# Altium schematic sheet Sheet1.SchDoc
size A3; SheetNumber: 1; SheetTotal: 1
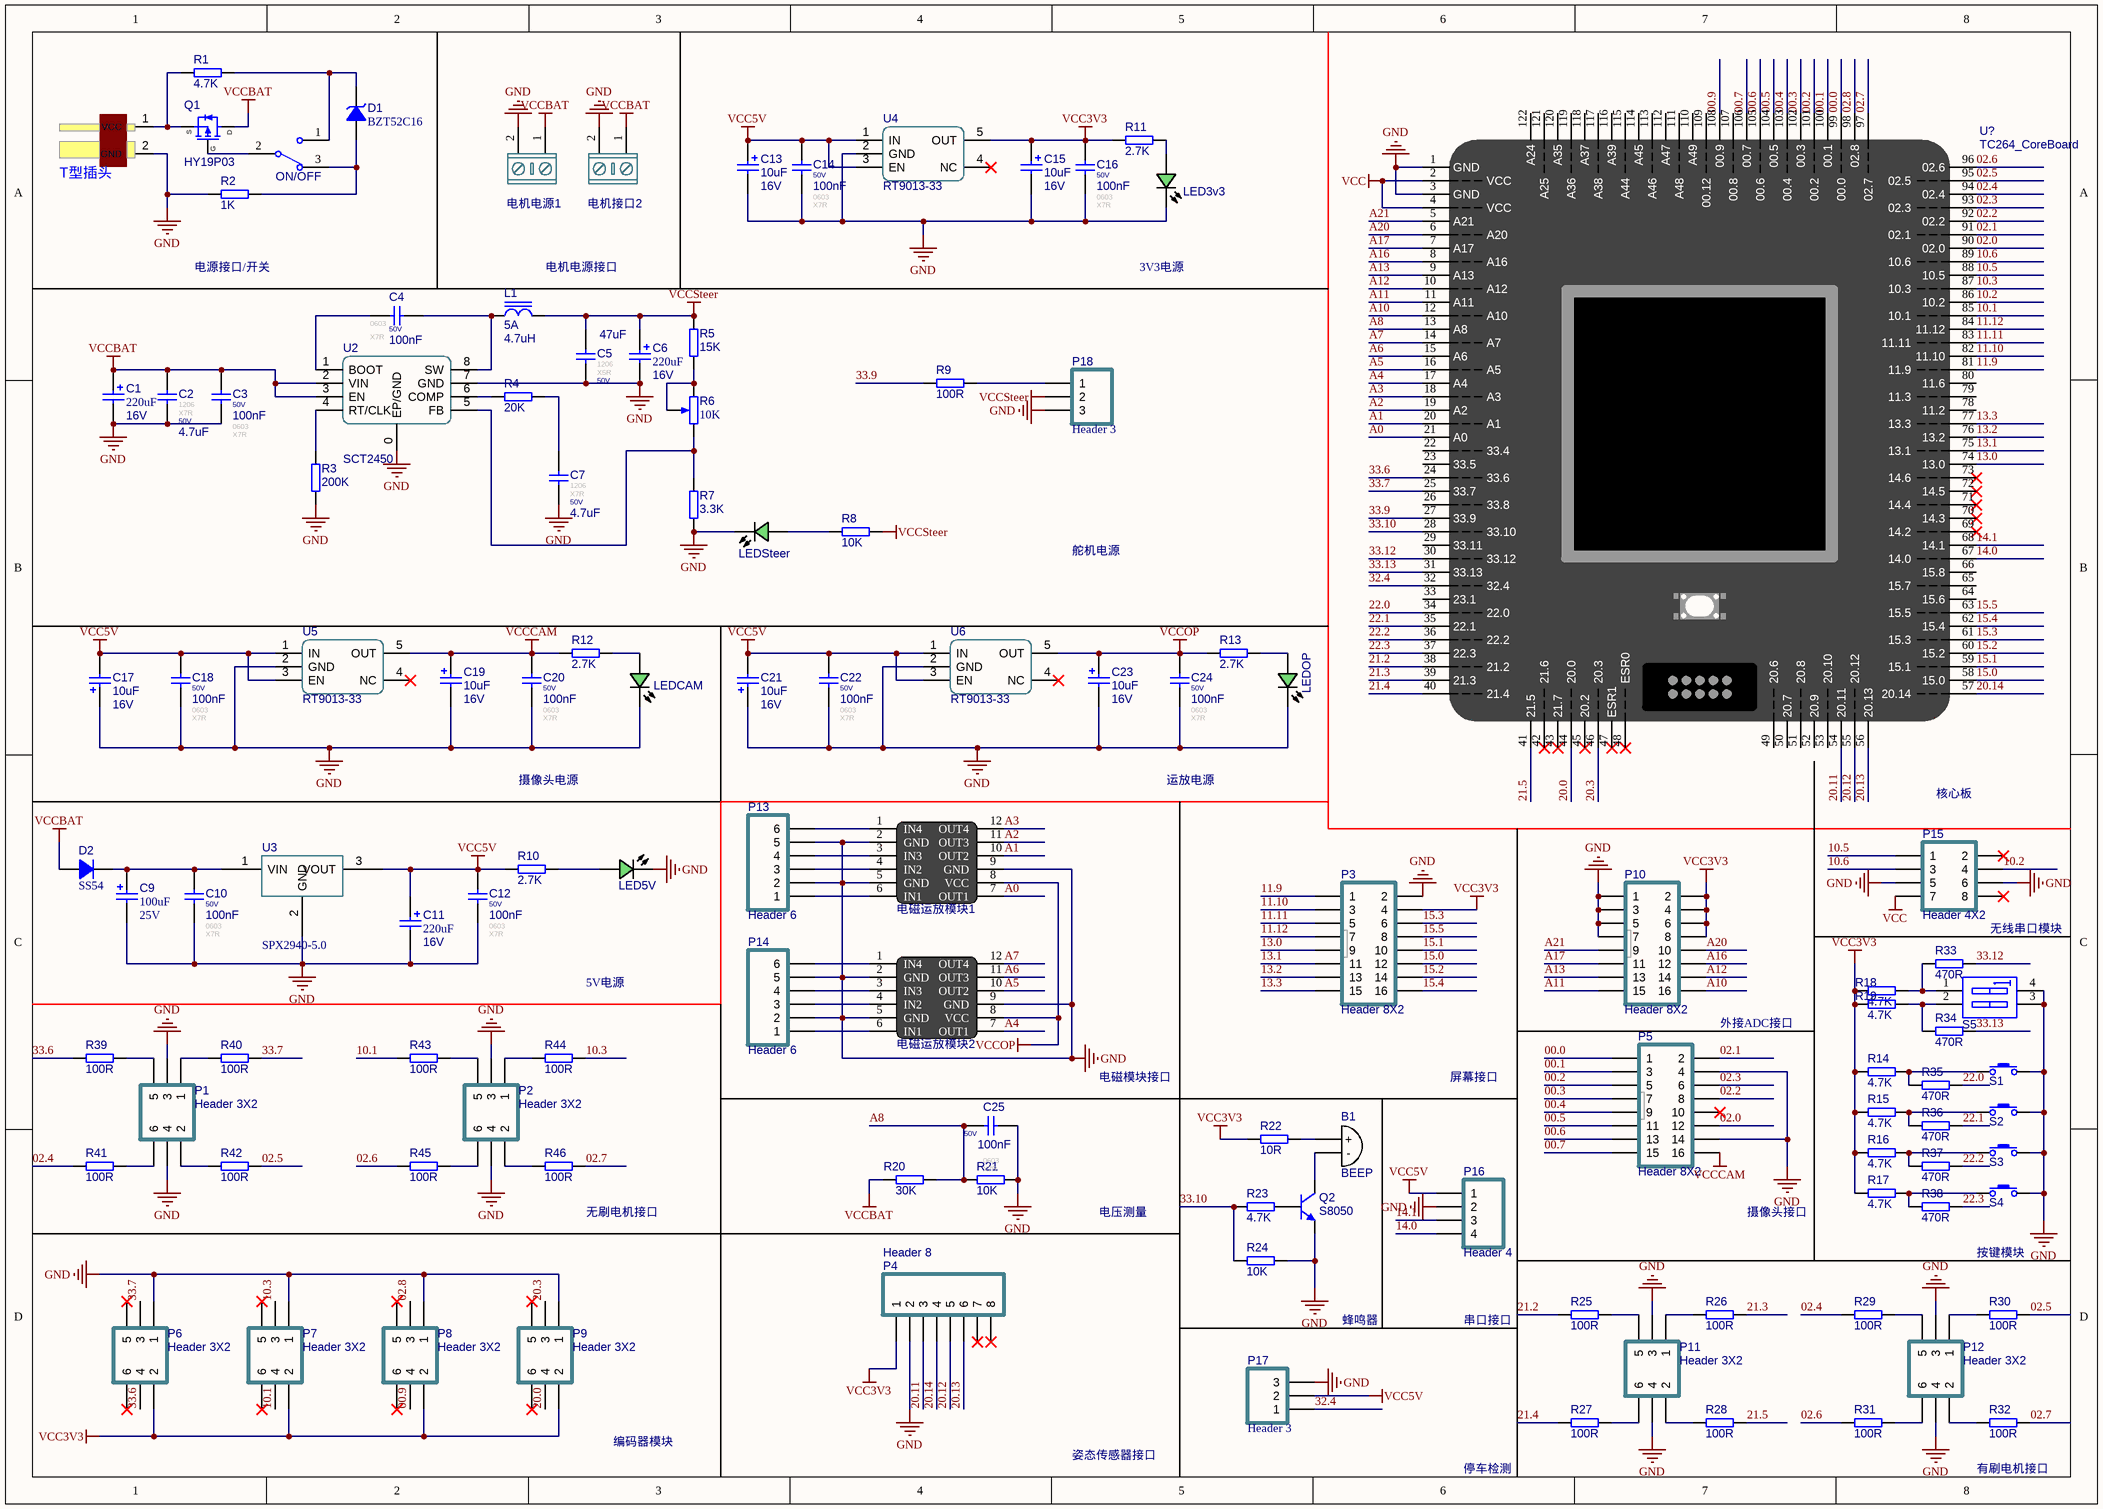
[diagram p0: Sheet1.SchDoc]

## Parts
B1  BEEP  [BEEP 9x5.5mm]
C1  value 220uF  Voltage: 16V  [CAPS6.3]  (hidden comment: 220uF 16V)
C2  value 4.7uF  Footprint: 1206  Type: X7R  Voltage: 50V  [CAPC3216[1206]S]  (hidden comment: 4.7uF ±10% 50V)
C3  value 100nF  Voltage: 50V  Footprint: 0603  Type: X7R  [CAPC3216[1206]S]  (hidden comment: 100nF ±10% 50V)
C4  value 100nF  Voltage: 50V  Footprint: 0603  Type: X7R  [CAPC3216[1206]S]  (hidden comment: 100nF ±10% 50V)
C5  value 47uF  Footprint: 1206  Type: X5R  Voltage: 50V  [CAPC3216[1206]S]  (hidden comment: 47uF ±10% 50V)
C6  value 220uF  Voltage: 16V  [CAPS6.3]  (hidden comment: 220uF 16V)
C7  value 4.7uF  Footprint: 1206  Type: X7R  Voltage: 50V  [CAPC3216[1206]S]  (hidden comment: 4.7uF ±10% 50V)
C9  value 100uF  Voltage: 25V  [CAPS6.3]  (hidden comment: 100uF 25V)
C10  value 100nF  Voltage: 50V  Footprint: 0603  Type: X7R  [CAPC3216[1206]S]  (hidden comment: 100nF ±10% 50V)
C11  value 220uF  Voltage: 16V  [CAPS6.3]  (hidden comment: 220uF 16V)
C12  value 100nF  Voltage: 50V  Footprint: 0603  Type: X7R  [CAPC3216[1206]S]  (hidden comment: 100nF ±10% 50V)
C13  value 10uF  Voltage: 16V  [CAPT3216]  (hidden comment: 10uF 16V)
C14  value 100nF  Voltage: 50V  Footprint: 0603  Type: X7R  [CAPC3216[1206]S]  (hidden comment: 100nF ±10% 50V)
C15  value 10uF  Voltage: 16V  [CAPT3216]  (hidden comment: 10uF 16V)
C16  value 100nF  Voltage: 50V  Footprint: 0603  Type: X7R  [CAPC3216[1206]S]  (hidden comment: 100nF ±10% 50V)
C17  value 10uF  Voltage: 16V  [CAPT3216]  (hidden comment: 10uF 16V)
C18  value 100nF  Voltage: 50V  Footprint: 0603  Type: X7R  [CAPC3216[1206]S]  (hidden comment: 100nF ±10% 50V)
C19  value 10uF  Voltage: 16V  [CAPT3216]  (hidden comment: 10uF 16V)
C20  value 100nF  Voltage: 50V  Footprint: 0603  Type: X7R  [CAPC3216[1206]S]  (hidden comment: 100nF ±10% 50V)
C21  value 10uF  Voltage: 16V  [CAPT3216]  (hidden comment: 10uF 16V)
C22  value 100nF  Voltage: 50V  Footprint: 0603  Type: X7R  [CAPC3216[1206]S]  (hidden comment: 100nF ±10% 50V)
C23  value 10uF  Voltage: 16V  [CAPT3216]  (hidden comment: 10uF 16V)
C24  value 100nF  Voltage: 50V  Footprint: 0603  Type: X7R  [CAPC3216[1206]S]  (hidden comment: 100nF ±10% 50V)
C25  value 100nF  Voltage: 50V  Footprint: 0603  Type: X7R  [CAPC3216[1206]S]  (hidden comment: 100nF ±10% 50V)
D1  BZT52C16  [SOD-123-L]
D2  SS54  [SMA[DO-214AC]]
L1  value 4.7uH  Imax: 5A  [0630 TPC 7*7*3]  (hidden comment: 4.7uH 5A)
LED3v3  翠绿贴片LED  [LEDC1608(0603)]  (value not drawn)
LED5V  翠绿贴片LED  [LEDC1608(0603)]  (value not drawn)
LEDCAM  翠绿贴片LED  [LEDC1608(0603)]  (value not drawn)
LEDOP  翠绿贴片LED  [LEDC1608(0603)]  (value not drawn)
LEDSteer  翠绿贴片LED  [LEDC1608(0603)]  (value not drawn)
ON/OFF  SW-SPDT  [SS12D10]  (value not drawn)
P1  Header 3X2  [HDR2X3-M-SMT]
P2  Header 3X2  [HDR2X3-M-SMT]
P3  Header 8X2  [HDR2X8-M-SMT]
P4  Header 8  [HDR1X8]
P5  Header 8X2  [HDR2X8-M-SMT]
P6  Header 3X2  [HDR2X3-M-SMT]
P7  Header 3X2  [HDR2X3-M-SMT]
P8  Header 3X2  [HDR2X3-M-SMT]
P9  Header 3X2  [HDR2X3-M-SMT]
P10  Header 8X2  [HDR2X8-M-SMT]
P11  Header 3X2  [HDR2X3-M-SMT]
P12  Header 3X2  [HDR2X3-M-SMT]
P13  Header 6  [HDR1X6]
P14  Header 6  [HDR1X6]
P15  Header 4X2  [Female-Header-2.54-SMD-8]
P16  Header 4  [HDR1X4]
P17  Header 3  [HDR1X3]
P18  Header 3  [HDR1X3]
Q1  HY19P03  [TO-252AA]
Q2  S8050  [SOT-23]
R1  value 4.7K  [RESC1608[0603]S-N]  (hidden comment: 4.7K ±1%)
R2  value 1K  [RESC1608[0603]S-N]  (hidden comment: 1K ±1%)
R3  value 200K  [RESC1608[0603]S-N]  (hidden comment: 200K ±1%)
R4  value 20K  [RESC1608[0603]S-N]  (hidden comment: 20K ±1%)
R5  value 15K  [RESC1608[0603]S-N]  (hidden comment: 15K ±1%)
R6  10K  [RESPOT3296]
R7  value 3.3K  [RESC1608[0603]S-N]  (hidden comment: 3.3K ±1%)
R8  value 10K  [RESC1608[0603]S-N]  (hidden comment: 10K ±1%)
R9  value 100R  [RESC1608[0603]S-N]  (hidden comment: 100R ±1%)
R10  value 2.7K  [RESC1608[0603]S-N]  (hidden comment: 2.7K ±1%)
R11  value 2.7K  [RESC1608[0603]S-N]  (hidden comment: 2.7K ±1%)
R12  value 2.7K  [RESC1608[0603]S-N]  (hidden comment: 2.7K ±1%)
R13  value 2.7K  [RESC1608[0603]S-N]  (hidden comment: 2.7K ±1%)
R14  value 4.7K  [RESC1608[0603]S-N]  (hidden comment: 4.7K ±1%)
R15  value 4.7K  [RESC1608[0603]S-N]  (hidden comment: 4.7K ±1%)
R16  value 4.7K  [RESC1608[0603]S-N]  (hidden comment: 4.7K ±1%)
R17  value 4.7K  [RESC1608[0603]S-N]  (hidden comment: 4.7K ±1%)
R18  value 4.7K  [RESC1608[0603]S-N]  (hidden comment: 4.7K ±1%)
R19  value 4.7K  [RESC1608[0603]S-N]  (hidden comment: 4.7K ±1%)
R20  value 30K  [RESC1608[0603]S-N]  (hidden comment: 30K ±1%)
R21  value 10K  [RESC1608[0603]S-N]  (hidden comment: 10K ±1%)
R22  value 10R  [RESC1608[0603]S-N]  (hidden comment: 10R ±1%)
R23  value 4.7K  [RESC1608[0603]S-N]  (hidden comment: 4.7K ±1%)
R24  value 10K  [RESC1608[0603]S-N]  (hidden comment: 10K ±1%)
R25  value 100R  [RESC1608[0603]S-N]  (hidden comment: 100R ±1%)
R26  value 100R  [RESC1608[0603]S-N]  (hidden comment: 100R ±1%)
R27  value 100R  [RESC1608[0603]S-N]  (hidden comment: 100R ±1%)
R28  value 100R  [RESC1608[0603]S-N]  (hidden comment: 100R ±1%)
R29  value 100R  [RESC1608[0603]S-N]  (hidden comment: 100R ±1%)
R30  value 100R  [RESC1608[0603]S-N]  (hidden comment: 100R ±1%)
R31  value 100R  [RESC1608[0603]S-N]  (hidden comment: 100R ±1%)
R32  value 100R  [RESC1608[0603]S-N]  (hidden comment: 100R ±1%)
R33  value 470R  [RESC1608[0603]S-N]  (hidden comment: 470R ±1%)
R34  value 470R  [RESC1608[0603]S-N]  (hidden comment: 470R ±1%)
R35  value 470R  [RESC1608[0603]S-N]  (hidden comment: 470R ±1%)
R36  value 470R  [RESC1608[0603]S-N]  (hidden comment: 470R ±1%)
R37  value 470R  [RESC1608[0603]S-N]  (hidden comment: 470R ±1%)
R38  value 470R  [RESC1608[0603]S-N]  (hidden comment: 470R ±1%)
R39  value 100R  [RESC1608[0603]S-N]  (hidden comment: 100R ±1%)
R40  value 100R  [RESC1608[0603]S-N]  (hidden comment: 100R ±1%)
R41  value 100R  [RESC1608[0603]S-N]  (hidden comment: 100R ±1%)
R42  value 100R  [RESC1608[0603]S-N]  (hidden comment: 100R ±1%)
R43  value 100R  [RESC1608[0603]S-N]  (hidden comment: 100R ±1%)
R44  value 100R  [RESC1608[0603]S-N]  (hidden comment: 100R ±1%)
R45  value 100R  [RESC1608[0603]S-N]  (hidden comment: 100R ±1%)
R46  value 100R  [RESC1608[0603]S-N]  (hidden comment: 100R ±1%)
S1  Button  [PTS810-3*4-CurvePin]  (value not drawn)
S2  Button  [PTS810-3*4-CurvePin]  (value not drawn)
S3  Button  [PTS810-3*4-CurvePin]  (value not drawn)
S4  Button  [PTS810-3*4-CurvePin]  (value not drawn)
S5  SW DIP-2  [Code SW-2-DIP-2.54]  (value not drawn)
U2  SCT2450  [SOP-8E]
U3  SPX2940-5.0  [TO-263-3]
U4  RT9013-33  [SOT-23-5]
U5  RT9013-33  [SOT-23-5]
U6  RT9013-33  [SOT-23-5]
U?  TC264_CoreBoard  [TC264_CoreBoard]
电机接口2  KF/WJ/DG 30x connecter  [KF/WJ/DG 301-2p-5.0mm]  (value not drawn)
电机电源1  KF/WJ/DG 30x connecter  [KF/WJ/DG 301-2p-5.0mm]  (value not drawn)
电源供电  T型插头  [Wired T-Header ThroughHole]
电磁运放模块1  OPA_MOD  [SEEKFREE_4CHANEL_OPAMOD]  (value not drawn)  (no BOM)
电磁运放模块2  OPA_MOD  [SEEKFREE_4CHANEL_OPAMOD]  (value not drawn)  (no BOM)

## Nets
GND: C1.2 C2.1 C3.1 C5.1 C6.2 C7.1 C9.2 C10.1 C11.2 C12.1 C13.2 C14.2 C15.2 C16.2 C17.1 C18.1 C19.2 C20.1 C21.1 C22.1 C23.2 C24.1 C25.2 LED3v3.C LED5V.C LEDCAM.C LEDOP.C LEDSteer.C P1.3 P1.4 P2.3 P2.4 P3.2 P4.2 P5.4 P5.14 P6.1 P7.1 P8.1 P9.1 P10.1 P10.3 P10.5 P10.7 P11.3 P11.4 P12.3 P12.4 P13.2 P13.5 P14.2 P14.5 P15.5 P15.6 P16.2 P17.3 P18.3 Q2.2(E) R2.1 R3.1 R7.1 R21.2 R24.2 S1.1 S2.1 S3.1 S4.1 S5.3(B2) S5.4(B1) U2.0(EP/GND) U2.7(GND) U3.2(GND) U4.2(GND) U5.2(GND) U6.2(GND) U?.1(GND) U?.3(GND) 电机接口2.2 电机电源1.2 电源供电.2(GND) 电磁运放模块1.2(GND) 电磁运放模块1.5(GND) 电磁运放模块1.9(GND) 电磁运放模块2.2(GND) 电磁运放模块2.5(GND) 电磁运放模块2.9(GND)
VCC: P15.7 U?.2(VCC) U?.4(VCC)
VCC3V3: C15.1 C16.1 P3.4 P4.1 P6.2 P7.2 P8.2 P9.2 P10.2 P10.4 P10.6 P10.8 R11.1 R14.1 R15.1 R16.1 R17.1 R18.1 R19.1 R22.1 U4.5(OUT)
VCC5V: C11.1 C12.2 C13.1 C14.1 C17.2 C18.2 C21.2 C22.2 P16.1 P17.2 R10.1 U3.3(VOUT) U4.1(IN) U4.3(EN) U5.1(IN) U5.3(EN) U6.1(IN) U6.3(EN)
VCCBAT: C1.1 C2.2 C3.2 D2.A Q1.1(D) R20.1 U2.2(VIN) U2.3(EN) 电机接口2.1 电机电源1.1
VCCCAM: C19.1 C20.2 P5.16 R12.1 U5.5(OUT)
VCCOP: C23.1 C24.2 R13.1 U6.5(OUT) 电磁运放模块1.8(VCC) 电磁运放模块2.8(VCC)
VCCSteer: C5.2 C6.1 L1.2 P18.2 R5.2 R8.2
00.0: P5.1 U?.99(00.0)
00.1: P5.3 U?.100(00.1)
00.2: P5.5 U?.101(00.2)
00.3: P5.7 U?.102(00.3)
00.4: P5.9 U?.103(00.4)
00.5: P5.11 U?.104(00.5)
00.6: P5.13 U?.105(00.6)
00.7: P5.15 U?.106(00.7)
00.9: P8.4 U?.108(00.9)
02.0: P5.12 U?.90(02.0)
02.1: P5.2 U?.91(02.1)
02.2: P5.8 U?.92(02.2)
02.3: P5.6 U?.93(02.3)
02.4: R29.1 R41.1 U?.94(02.4)
02.5: R30.2 R42.2 U?.95(02.5)
02.6: R31.1 R45.1 U?.96(02.6)
02.7: R32.2 R46.2 U?.97(02.7)
02.8: P8.3 U?.98(02.8)
10.1: P7.4 R43.1 U?.85(10.1)
10.2: P15.4 U?.86(10.2)
10.3: P7.3 R44.2 U?.87(10.3)
10.5: P15.1 U?.88(10.5)
10.6: P15.3 U?.89(10.6)
11.9: P3.1 U?.81(11.9)
11.10: P3.3 U?.82(11.10)
11.11: P3.5 U?.83(11.11)
11.12: P3.7 U?.84(11.12)
13.0: P3.9 U?.74(13.0)
13.1: P3.11 U?.75(13.1)
13.2: P3.13 U?.76(13.2)
13.3: P3.15 U?.77(13.3)
14.0: P16.4 U?.67(14.0)
14.1: P16.3 U?.68(14.1)
15.0: P3.12 U?.58(15.0)
15.1: P3.10 U?.59(15.1)
15.2: P3.14 U?.60(15.2)
15.3: P3.6 U?.61(15.3)
15.4: P3.16 U?.62(15.4)
15.5: P3.8 U?.63(15.5)
20.0: P9.4 U?.44(20.0)
20.3: P9.3 U?.46(20.3)
20.11: P4.3 U?.54(20.11)
20.12: P4.5 U?.55(20.12)
20.13: P4.6 U?.56(20.13)
20.14: P4.4 U?.57(20.14)
21.2: R25.1 U?.38(21.2)
21.3: R26.2 U?.39(21.3)
21.4: R27.1 U?.40(21.4)
21.5: R28.2 U?.41(21.5)
22.0: R35.2 U?.34(22.0)
22.1: R36.2 U?.35(22.1)
22.2: R37.2 U?.36(22.2)
22.3: R38.2 U?.37(22.3)
32.4: P17.1 U?.32(32.4)
33.6: P6.4 R39.1 U?.24(33.6)
33.7: P6.3 R40.2 U?.25(33.7)
33.9: R9.1 U?.27(33.9)
33.10: R23.1 R24.1 U?.28(33.10)
33.12: R33.2 U?.30(33.12)
33.13: R34.2 U?.31(33.13)
A0: U?.21(A0) 电磁运放模块1.7(OUT1)
A1: U?.20(A1) 电磁运放模块1.10(OUT2)
A2: U?.19(A2) 电磁运放模块1.11(OUT3)
A3: U?.18(A3) 电磁运放模块1.12(OUT4)
A4: U?.17(A4) 电磁运放模块2.7(OUT1)
A5: U?.16(A5) 电磁运放模块2.10(OUT2)
A6: U?.15(A6) 电磁运放模块2.11(OUT3)
A7: U?.14(A7) 电磁运放模块2.12(OUT4)
A8: C25.1 R20.2 R21.1 U?.13(A8)
A10: P10.16 U?.12(A10)
A11: P10.15 U?.11(A11)
A12: P10.14 U?.10(A12)
A13: P10.13 U?.9(A13)
A16: P10.12 U?.8(A16)
A17: P10.11 U?.7(A17)
A20: P10.10 U?.6(A20)
A21: P10.9 U?.5(A21)
NetB1_1: B1.1(+) R22.2
NetB1_2: B1.2(-) Q2.3(C)
NetC4_1: C4.1 U2.1(BOOT)
NetC4_2: C4.2 L1.1 U2.8(SW)
NetC7_2: C7.2 R4.2
NetC9_1: C9.1 C10.2 D2.K U3.1(VIN)
NetD1_A: D1.A ON/OFF.3 R2.2
NetD1_K: D1.K ON/OFF.1 R1.2
NetLED3v3_A: LED3v3.A R11.2
NetLED5V_A: LED5V.A R10.2
NetLEDCAM_A: LEDCAM.A R12.2
NetLEDOP_A: LEDOP.A R13.2
NetLEDSteer_A: LEDSteer.A R8.1
NetON/OFF_2: ON/OFF.2 Q1.2(G)
NetP1_1: P1.1 R40.1
NetP1_2: P1.2 R42.1
NetP1_5: P1.5 R39.2
NetP1_6: P1.6 R41.2
NetP2_1: P2.1 R44.1
NetP2_2: P2.2 R46.1
NetP2_5: P2.5 R43.2
NetP2_6: P2.6 R45.2
NetP11_1: P11.1 R26.1
NetP11_2: P11.2 R28.1
NetP11_5: P11.5 R25.2
NetP11_6: P11.6 R27.2
NetP12_1: P12.1 R30.1
NetP12_2: P12.2 R32.1
NetP12_5: P12.5 R29.2
NetP12_6: P12.6 R31.2
NetP13_1: P13.1 电磁运放模块1.6(IN1)
NetP13_3: P13.3 电磁运放模块1.4(IN2)
NetP13_4: P13.4 电磁运放模块1.3(IN3)
NetP13_6: P13.6 电磁运放模块1.1(IN4)
NetP14_1: P14.1 电磁运放模块2.6(IN1)
NetP14_3: P14.3 电磁运放模块2.4(IN2)
NetP14_4: P14.4 电磁运放模块2.3(IN3)
NetP14_6: P14.6 电磁运放模块2.1(IN4)
NetP18_1: P18.1 R9.2
NetQ1_3: Q1.3(S) R1.1 电源供电.1(VCC)
NetQ2_1: Q2.1(B) R23.2
NetR3_2: R3.2 U2.4(RT/CLK)
NetR4_1: R4.1 U2.6(COMP)
NetR5_1: R5.1 R6.1(TOP) R6.ADJ
NetR6_2: R6.2(BOT) R7.2 U2.5(FB)
NetR14_2: R14.2 R35.1 S1.2
NetR15_2: R15.2 R36.1 S2.2
NetR16_2: R16.2 R37.1 S3.2
NetR17_2: R17.2 R38.1 S4.2
NetR18_2: R18.2 R33.1 S5.1(A1)
NetR19_2: R19.2 R34.1 S5.2(A2)

Not connected (* = marked no-connect by the designer): P4 7* 8*; P5 10*; P6 5* 6*; P7 5* 6*; P8 5* 6*; P9 5* 6*; P15 2* 8*; U4 4(NC)*; U5 4(NC)*; U6 4(NC)*; U? 22(33.4) 23(33.5) 26(33.8) 29(33.11) 33(23.1) 42(21.6)* 43(21.7)* 45(20.2)* 47(ESR1)* 48(ESR0)* 49(20.6) 50(20.7) 51(20.8) 52(20.9) 53(20.10) 64(15.6) 65(15.7) 66(15.8) 69(14.2)* 70(14.3)* 71(14.4)* 72(14.5)* 73(14.6)* 78(11.2) 79(11.3) 80(11.6) 107(00.8) 109(00.12) 110(A49) 111(A48) 112(A47) 113(A46) 114(A45) 115(A44) 116(A39) 117(A38) 118(A37) 119(A36) 120(A35) 121(A25) 122(A24)

## Notes on the sheet
- 电源接口/开关
- (near L1) 电机电源接口
- 3V3电源
- 舵机电源
- 摄像头电源
- 运放电源
- 核心板
- 5V电源
- 无线串口模块
- 外接ADC接口
- 电磁模块接口
- 屏幕接口
- (near R46) 无刷电机接口
- 电压测量
- 摄像头接口
- 按键模块
- 蜂鸣器
- 串口接口
- 编码器模块
- 姿态传感器接口
- 停车检测
- (near R32) 有刷电机接口

## Library data of the parts
B1 = BEEP: 蜂鸣器
C1 C6 C11 = Cap-Solid_1: Polarized Capacitor (Radial); Published: 8-Jun-2000; Revision: July-2002: Re-released for DXP Platform.; Publisher: Altium Limited; Price(RMB): 0.000
C2 C7 = Cap-Chip_1: 贴片电容; Published: 2021-12-13; Revision: V1.2; Tolerance: ±10%
C3 C4 C10 C12 C14 C16 C18 C20 C22 C24 C25 = Cap-Chip: 贴片电容; Published: 2021-12-13; Revision: V1.2; Tolerance: ±10%
C5 = Cap-Chip_2: 贴片电容; Published: 2021-12-13; Revision: V1.2; Tolerance: ±10%
C9 = Cap-Solid: Polarized Capacitor (Radial); Published: 8-Jun-2000; Revision: July-2002: Re-released for DXP Platform.; Publisher: Altium Limited; Price(RMB): 0.000
C13 C15 C17 C19 C21 C23 = Cap-Tan: Tantalum Capacitor; Published: 8-Jun-2000; Revision: July-2002: Re-released for DXP Platform.; Publisher: Altium Limited; Price(RMB): 0.000
D1 = Diode TVS Uni-Dir: TRANSIENT VOLTAGE  SUPPRESSOR DIODE; Imax: 500mA; Published: 8-Jun-2000; Publisher: Altium Limited; Price(RMB): 0.000
D2 = Diode: 普通二极管 Diode; Imax: 500mA; Published: 8-Jun-2000; Revision: July-2002: Re-released for DXP Platform.; Publisher: Altium Limited; Price(RMB): 0.000
L1 = Ind-Power: 功率电感; DCR: .5m; Published: 8-Jun-2000; Revision: July-2002: Re-released for DXP Platform.; Publisher: Altium Limited; Price(RMB): 0.000
LED3v3 LED5V LEDCAM LEDOP LEDSteer = LED Chip Green: Published: 8-Jun-2000; Revision: July-2002: Re-released for DXP Platform.; Publisher: Altium Limited; Price(RMB): 0.00
ON/OFF = SW-SPDT: 单刀双掷开关 3脚船型、钮子、拨动开关 SPDT Subminiature Toggle Switch; Published: 24-Mar-1999; Publisher: Altium Limited; Price(RMB): 0.000
P1 P2 P6-P9 P11 P12 = Header 3X2: Header, 3-Pin, Dual row; LatestRevisionDate: 17-Jul-2002; LatestRevisionNote: Re-released for DXP Platform.; Publisher: Altium Limited; Price(RMB): 0.00
P3 P5 P10 = Header 8X2: Header, 8-Pin, Dual row; LatestRevisionDate: 17-Jul-2002; LatestRevisionNote: Re-released for DXP Platform.; Publisher: Altium Limited; Price(RMB): 0.00
P4 = Header 8: Header, 8-Pin; LatestRevisionDate: 17-Jul-2002; LatestRevisionNote: Re-released for DXP Platform.; Publisher: Altium Limited; Price(RMB): 0.00
P13 P14 = Header 6: Header, 6-Pin; LatestRevisionDate: 17-Jul-2002; LatestRevisionNote: Re-released for DXP Platform.; Publisher: Altium Limited; Price(RMB): 0.00
P15 = Header 4X2: Header, 4-Pin, Dual row; LatestRevisionDate: 17-Jul-2002; LatestRevisionNote: Re-released for DXP Platform.; Publisher: Altium Limited; Price(RMB): 0.00
P16 = Header 4: Header, 4-Pin; LatestRevisionDate: 17-Jul-2002; LatestRevisionNote: Re-released for DXP Platform.; Publisher: Altium Limited; Price(RMB): 0.00
P17 P18 = Header 3: Header, 3-Pin; LatestRevisionDate: 17-Jul-2002; LatestRevisionNote: Re-released for DXP Platform.; Publisher: Altium Limited; Price(RMB): 0.00
Q1 = HY19P03: HY19P03 P-Channel MOSFET
Q2 = NPN S8050: Discrete NPN Bipolar Transistor; Published: 8-Jun-2000; Revision: July-2002: Re-released for DXP Platform.; Publisher: Altium Limited; Price(RMB): 0.000; PartNumber: S8050
R1 R14-R19 R23 = Res-Chip_4: 贴片电阻; Published: 8-Jun-2000; Revision: July-2002: Re-released for DXP Platform.; Tolerance: ±1%
R2 = Res-Chip_3: 贴片电阻; Published: 8-Jun-2000; Revision: July-2002: Re-released for DXP Platform.; Tolerance: ±1%
R3 = Res-Chip_5: 贴片电阻; Published: 8-Jun-2000; Revision: July-2002: Re-released for DXP Platform.; Tolerance: ±1%
R4 = Res-Chip_6: 贴片电阻; Published: 8-Jun-2000; Revision: July-2002: Re-released for DXP Platform.; Tolerance: ±1%
R5 = Res-Chip_7: 贴片电阻; Published: 8-Jun-2000; Revision: July-2002: Re-released for DXP Platform.; Tolerance: ±1%
R6 = Res-Adj-3p: 可调电阻; Value: 10K
R7 = Res-Chip_8: 贴片电阻; Published: 8-Jun-2000; Revision: July-2002: Re-released for DXP Platform.; Tolerance: ±1%
R8 R21 R24 = Res-Chip: 贴片电阻; Published: 8-Jun-2000; Revision: July-2002: Re-released for DXP Platform.; Tolerance: ±1%
R9 R25-R32 R39-R46 = Res-Chip_1: 贴片电阻; Published: 8-Jun-2000; Revision: July-2002: Re-released for DXP Platform.; Tolerance: ±1%
R10-R13 = Res-Chip_2: 贴片电阻; Published: 8-Jun-2000; Revision: July-2002: Re-released for DXP Platform.; Tolerance: ±1%
R20 = Res-Chip_9: 贴片电阻; Published: 8-Jun-2000; Revision: July-2002: Re-released for DXP Platform.; Tolerance: ±1%
R22 = Res-Chip_10: 贴片电阻; Published: 8-Jun-2000; Revision: July-2002: Re-released for DXP Platform.; Tolerance: ±1%
R33-R38 = Res-Chip_11: 贴片电阻; Published: 8-Jun-2000; Revision: July-2002: Re-released for DXP Platform.; Tolerance: ±1%
S1-S4 = KEY: 按键; Published: 24-Mar-1999; Publisher: Altium Limited; Price(RMB): 0.000
S5 = Code SW-2: 2位拨码开关; Published: 24-Mar-1999; Revision: July-2002: Re-released for DXP Platform.; Publisher: Altium Limited; Price(RMB): 0.000
U2 = SCT2450: 3.8V-36V Vin, 5A, High Efficiency Synchronous Step-down DCDC Converter / with Programmable Frequency
U3 = LM2940-5.0: 5V LDO TO-263-3
U4-U6 = RT9013-33: 3.3V 500mA SOT-23-5 LDO
U? = TC264_CoreBoard: 逐飞科技TC264核心板
电机接口2 电机电源1 = KF/WJ/DG 30x: 接线端子 2Pin
电源供电 = T_Header
电磁运放模块1 电磁运放模块2 = OPA_4CHANNEL_SEEKFREE: OPA module